# Altium schematic sheet Schema_nixie1.SchDoc
size A4; SheetNumber: 1; SheetTotal: 1
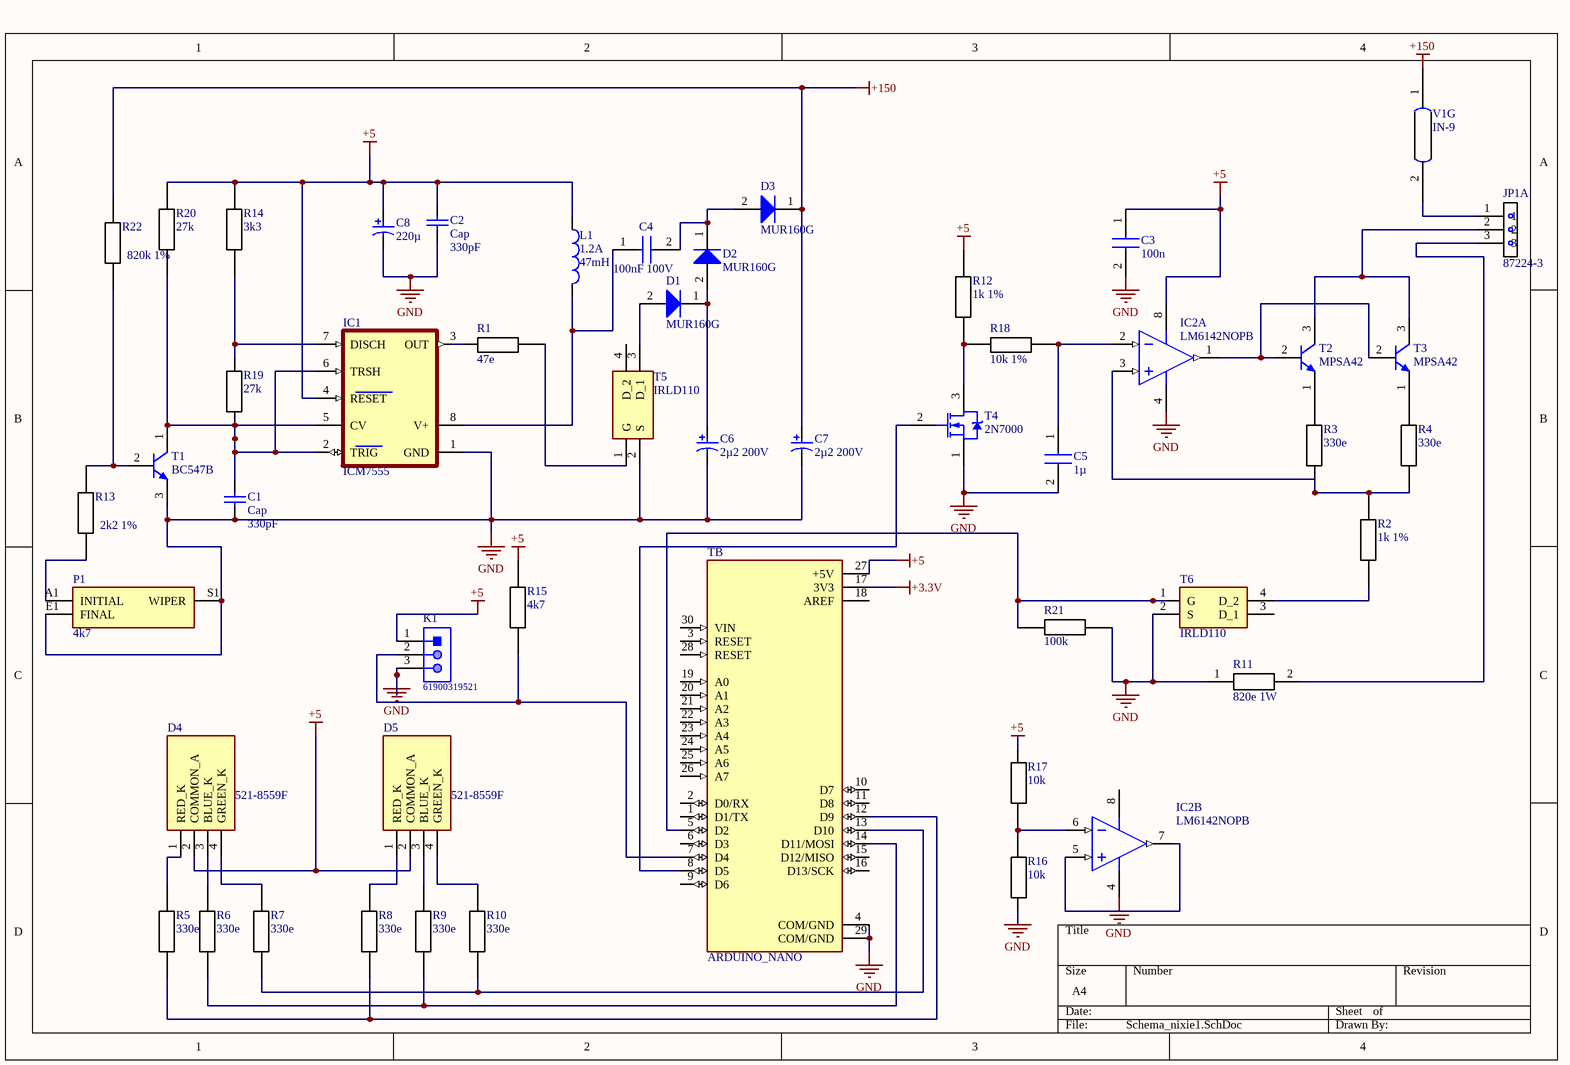
[diagram p0: Schema_nixie1.SchDoc]

## Parts
(Parts that share a designator on the sheet are numbered #1, #2 ... from top to bottom, then left to right.)
C1  Cap  value 330pF  [RAD-0.3]
C2  Cap  value 330pF  [RAD-0.3]
C3  100n  [C330C105K5R5TA7303]
C4  100nF 100V  [BFC247086104]
C5  1µ  [C330C105K5R5TA7303]
C6  2µ2 200V  [CAPPR55-200-1100X500X1200]
C7  2µ2 200V  [CAPPR55-200-1100X500X1200]
C8  220µ  [CAPPR55-200-1100X500X1200]
D1  MUR160G  [ONSC-AXIAL_LEAD-2-59-10_P]
D2  MUR160G  [ONSC-AXIAL_LEAD-2-59-10_P]
D3  MUR160G  [ONSC-AXIAL_LEAD-2-59-10_P]
D4  521-8559F  [5218559F]
D5  521-8559F  [5218559F]
IC1  ICM7555  [DIL08]
IC2#1  LM6142NOPB  [D0008A_L]  (part A of 2)
IC2#2  LM6142NOPB  [D0008A_L]  (part B of 2)
JP1  87224-3  [872243]  (part A of 3)
K1  61900319521  [61900319521]
L1  1.2A  value 47mH  [LHL08TB100K]
P1  4k7  [PT10LV10205A2020S]
R1  47e  [6-0805_N]
R2  1k 1%  [6-0805_N]
R3  330e  [6-0805_N]
R4  330e  [6-0805_N]
R5  330e  [6-0805_N]
R6  330e  [6-0805_N]
R7  330e  [6-0805_N]
R8  330e  [6-0805_N]
R9  330e  [6-0805_N]
R10  330e  [6-0805_N]
R11  820e 1W  [AXIAL-0.7]
R12  1k 1%  [6-0805_N]
R13  2k2 1%  [6-0805_N]
R14  3k3  [6-0805_N]
R15  4k7  [6-0805_N]
R16  10k  [6-0805_N]
R17  10k  [6-0805_N]
R18  10k 1%  [6-0805_N]
R19  27k  [6-0805_N]
R20  27k  [6-0805_N]
R21  100k  [6-0805_N]
R22  820k 1%  [6-0805_N]
T1  BC547B  [ONSC-TO-92-3-29-11]
T2  MPSA42  [ONSC-TO-92-3-29-11]
T3  MPSA42  [ONSC-TO-92-3-29-11]
T4  2N7000  [ONSC-TO-92-3-29-11]
T5  IRLD110  [DIP920W60P254L490H337Q4N]
T6  IRLD110  [DIP920W60P254L490H337Q4N]
TB  ARDUINO_NANO  [SHIELD_ARDUINO_NANO]
V1  IN-9  [PCBComponent_1]  (part G of 7)

## Nets
+3.3V: TB.17(3V3)
+5: C2.2 C3.1 C8.1 D4.2(COMMON_A) D5.2(COMMON_A) IC1.4(RESET) IC2#1.8(V+) K1.1 L1.1 R12.1 R14.1 R15.1 R17.2 R20.1 TB.27(+5V)
+150: C7.1 D3.1(K) R22.1 V1.1
GND: C1.1 C2.1 C3.2 C5.2 C6.2 C7.2 C8.2 IC1.1(GND) IC2#1.4(V-) IC2#2.4(V-) K1.3 P1.E1(FINAL) P1.S1(WIPER) R11.1 R16.1 R21.1 T1.3(E) T4.1(S) T5.2(S) T6.2(S) TB.4(COM/GND) TB.29(COM/GND)
NetC1_2: C1.2 IC1.2(TRIG) IC1.5(CV) IC1.6(TRSH) R19.2 R20.2 T1.1(C)
NetC4_1: C4.1 IC1.8(V+) L1.2
NetC4_2: C4.2 D2.1(K) D3.2(A)
NetC5_1: C5.1 IC2#1.2(INA-) R18.2
NetC6_1: C6.1 D1.1(K) D2.2(A)
NetD1_2: D1.2(A) T5.3(D_1)
NetD4_1: D4.1(RED_K) R5.1
NetD4_3: D4.3(BLUE_K) R6.1
NetD4_4: D4.4(GREEN_K) R7.1
NetD5_1: D5.1(RED_K) R8.1
NetD5_3: D5.3(BLUE_K) R9.1
NetD5_4: D5.4(GREEN_K) R10.1
NetIC1_3: IC1.3(OUT) R1.1
NetIC1_7: IC1.7(DISCH) R14.2 R19.1
NetIC2#1_1: IC2#1.1(OUTA) T2.2(B) T3.2(B)
NetIC2#1_3: IC2#1.3(INA+) R2.1 R3.2 R4.2
NetIC2#2_5: IC2#2.5(INB+) IC2#2.7(OUTB)
NetIC2#2_6: IC2#2.6(INB-) R16.2 R17.1
NetJP1_1: JP1.1 V1.2
NetJP1_2: JP1.2 T2.3(C) T3.3(C)
NetJP1_3: JP1.3 R11.2
NetK1_2: K1.2 R15.2 TB.7(D4)
NetP1_A1: P1.A1(INITIAL) R13.2
NetR1_2: R1.2 T5.1(G)
NetR2_2: R2.2 T6.4(D_2)
NetR3_1: R3.1 T2.1(E)
NetR4_1: R4.1 T3.1(E)
NetR5_2: R5.2 R8.2 TB.12(D9)
NetR6_2: R6.2 R9.2 TB.14(D11/MOSI)
NetR7_2: R7.2 R10.2 TB.13(D10)
NetR12_2: R12.2 R18.1 T4.3(D)
NetR13_1: R13.1 R22.2 T1.2(B)
NetR21_2: R21.2 T6.1(G) TB.5(D2)
NetT4_2: T4.2(G) TB.8(D5)

Not connected (* = marked no-connect by the designer): IC2#2 8(V+); T5 4(D_2); T6 3(D_1); TB 1(D1/TX) 2(D0/RX) 3(RESET) 6(D3) 9(D6) 10(D7) 11(D8) 15(D12/MISO) 16(D13/SCK) 18(AREF) 19(A0) 20(A1) 21(A2) 22(A3) 23(A4) 24(A5) 25(A6) 26(A7) 28(RESET) 30(VIN)

## Library data of the parts
C1 C2 = Cap: Capacitor; Published: 8-Jun-2000; LatestRevisionDate: 17-Jul-2002; LatestRevisionNote: Re-released for DXP Platform.; PackageReference: RAD-0.3; Publisher: Altium Limited; PackageDescription: Radial Cap, Thru-Hole; 2 Leads; 0.3 in Pin Spacing
C3 C5 = C330C105K5R5TA7303: Capacitor; Manufacturer_Name: Kemet; Datasheet Link: https://content.kemet.com/datasheets/KEM_C1050_GOLDMAX_X7R.pdf; Height: 10.66mm; Manufacturer_Part_Number: C330C105K5R5TA7303; Mouser Part Number: 80-C330C105K5R-TR; Mouser Price/Stock: https://www.mouser.com/Search/Refine.aspx?Keyword=80-C330C105K5R-TR; Arrow Part Number: C330C105K5R5TA7303; Arrow Price/Stock: https://www.arrow.com/en/products/c330c105k5r5ta7303/kemet-corporation
C4 = BFC247086104: Capacitor; Manufacturer_Name: Vishay; Datasheet Link: https://www.vishay.com/docs/28112/mkt470.pdf; Height: 8mm; Manufacturer_Part_Number: BFC247086104; Mouser Part Number: 594-2222-470-86104; Mouser Price/Stock: https://www.mouser.co.uk/ProductDetail/Vishay-BC-Components/BFC247086104?qs=m9M%252B25nfdj%2FpVccp3IS4nw%3D%3D; Arrow Part Number: BFC247086104; Arrow Price/Stock: https://www.arrow.com/en/products/bfc247086104/vishay
C6-C8 = CMP-1665-00038-2: Aluminum Electrolytic Capacitor, 10 uF, +/- 20%, 50 V, -40 to 85 degC, 2-Pin THD, RoHS, Bulk; Manufacturer: Panasonic; Life (Hours): 2000Hour; Lead/Base Style: Straight; Dissipation Factor: 0.12%; Capacitance: 10uF; Leakage Current: 3uA; Dielectric Material: Aluminium; Lead Diameter: 0.5mm; Voltage Rating: 50V; Ripple Current: 65mA; Package Reference: CAPPR55-200-1100X500X1200; Height: 11mm; Diameter: 5mm; REACH SVHC: NoSVHC; Mount: ThroughHole; Packaging: Bulk; Manufacturer URL: http://www.panasonic.com/; Termination: Radial; Datasheet URL: https://industrial.panasonic.com/cdbs/www-data/pdf/RDF0000/ABA0000C1218.pdf; Lead Free: LeadFree; Height - Seated (Max): 0.472inch; Case/Package: Radial; Package Description: 2-Pin Radial Lead, Dia 5 mm, Height 12 mm; Tolerance: 20%; Datasheet Version: Rev. 05, 10/2016; Package Quantity: 200; Ripple Current (AC): 65mA; Min Operating Temperature: -40degC; RoHSCompliant: true; Number of Pins: 2; Max Operating Temperature: 85degC; Voltage: 50V; Lead Pitch: 2mm; Radiation Hardening: No; Voltage Rating (DC): 50V; Length: 11mm
D1-D3 = CMP-0902-00129-1: SWITCHMODE(TM) Power Rectifier, 2-Pin Axial_Lead, Pb-Free, Bulk Bag; Manufacturer: On Semiconductor; IFSM Max (A): 35; VRRM Max (V): 600; Type: Ultrafast; PackageVersion: Rev. U, 02/2005; PackageDescription: 2-Pin, Axial Lead, Diameter 2.35 mm; RoHS: TRUE; ComponentLink3Description: Package Specification; ComponentLink3URL: http://www.onsemi.cn/pub_link/Collateral/59-10.PDF; Packing: Bulk Bag; ComponentLink1URL: http://www.onsemi.com/; ComponentLink1Description: Manufacturer URL; ComponentLink2Description: Datasheet; ComponentLink2URL: http://www.onsemi.com/pub_link/Collateral/MUR120-D.PDF; PackageReference: AXIAL_LEAD-2-59-10; Mounting Technology: Through Hole; PartNumber: MUR160G; DatasheetVersion: Rev. 12
D4 D5 = 521-8559F: LED; Manufacturer_Name: Dialight; Datasheet Link: http://www.dialightsignalsandcomponents.com/Assets/Drawings/2D_Drawings_DrawingDetailedSpec/NewDrawings/C18455B.pdf; Height: 8.6mm; Manufacturer_Part_Number: 521-8559F; Mouser Part Number: 645-5218559F; Mouser Price/Stock: https://www.mouser.co.uk/ProductDetail/Dialight/521-8559F/?qs=vmHwEFxEFR%2FyCJVY9sdZTA%3D%3D
IC1 = ICM7555: 555 Tipo, Temporizador / Oscilador (Ãšnico) IC 1MHz 8-SOIC; MF: Renesas Electronics; Availability: Unavailable; Check_prices: https://www.snapeda.com/parts/ICM7555/Renesas%20Electronics%20America%20Inc./view-part/571575/?ref=eda; Value: *; Package: SOIC-8 Renesas Electronics; MP: ICM7555; Price: None; SnapEDA_Link: https://www.snapeda.com/parts/ICM7555/Renesas%20Electronics%20America%20Inc./view-part/571575/?ref=snap
IC2#1 = CMP-0055-00755-3: Dual High Speed/Low Power 17 MHz Rail-to-Rail I/O Operational Amplifier, 8-pin Narrow SOIC, Pb-Free; Manufacturer: Texas Instruments; PackageTopMarking: NSZXTT*LM614*2BIM; PowerWise: N; CompType: Amplifiers; PackageDescription: SOIC Narrow, 4.9 x 3.9 x 1.45mm, 8 Lead, 1.27mm Pitch; ComponentLink1Description: Datasheet URL; Package Reference: D0008A; PinCount: 8; Code_IPC: SOIC127P600-8; RoHS: Y; ComponentLink1URL: http://www.ti.com/general/docs/lit/getliterature.tsp?genericPartNumber=LM6142&fileType=pdf; Code_JEDEC: MS-012-AA
IC2#2 = CMP-0055-00755-3: Dual High Speed/Low Power 17 MHz Rail-to-Rail I/O Operational Amplifier, 8-pin Narrow SOIC, Pb-Free; Manufacturer: Texas Instruments; Manufacturer: TI National Semiconductor; Manufacturer Part Number: LM6142BIM/NOPB; PackageTopMarking: NSZXTT*LM614*2BIM; PowerWise: N; CompType: Amplifiers; PackageDescription: SOIC Narrow, 4.9 x 3.9 x 1.45mm, 8 Lead, 1.27mm Pitch; ComponentLink1Description: Datasheet URL; Package Reference: D0008A; PinCount: 8; Code_IPC: SOIC127P600-8; RoHS: Y; ComponentLink1URL: http://www.ti.com/general/docs/lit/getliterature.tsp?genericPartNumber=LM6142&fileType=pdf; Code_JEDEC: MS-012-AA
JP1 = 87224-3: Connector; Manufacturer_Name: TE Connectivity; Datasheet Link: https://www.mouser.com/datasheet/2/418/NG_CD_87224_L3-1263161.pdf; Height: 10.3632mm; Manufacturer_Part_Number: 87224-3; Mouser Part Number: 571-872243; Mouser Price/Stock: https://www.mouser.co.uk/ProductDetail/TE-Connectivity/87224-3?qs=VKrXD49J9ErediZOfWku7Q%3D%3D; Arrow Part Number: 87224-3; Arrow Price/Stock: https://www.arrow.com/en/products/87224-3/te-connectivity
K1 = CMP-1502-00600-1: Male Top Locking Header WR-WTB, THT, Right Angled, pitch 2.54 mm, 1 x 3 position; Manufacturer: Wurth Elektronik; Working Voltage: 250VAC; Pitch: 2.54mm; Position: 1x3; Contact Resistance: 20mOhm; Package Reference: 61900319521; Manufacturer URL: http://www.we-online.de; Orientation: RightAngled; Operating Temperature: -40to105degC; Publisher: WurthElektronik; Packaging: Bag; Datasheet URL: https://katalog.we-online.de/em/datasheet/6190xx19521.pdf; Gender: Male; Mounting Technology: THT; Part Number: 61900319521
L1 = Inductor: Code_IEC: 1005; Published: 8-Jun-2000; LatestRevisionDate: 29-May-2009; LatestRevisionNote: IPC-7351 Footprint Added.; PackageReference: 0402-A; Publisher: Altium Limited; PackageDescription: Chip Inductor; Code_JEITA: 0402
P1 = PT10LV10-205A2020-S: Variable Resistor; Manufacturer_Name: PIHER; Datasheet Link: https://www.mouser.in/datasheet/2/18/1/12_PT10v03-1499201.pdf; Height: 6.2mm; Manufacturer_Part_Number: PT10LV10-205A2020-S
R1-R10 R12-R22 = Res Thermal: resistor; Published: 24-Mar-1999; LatestRevisionDate: 29-May-2009; LatestRevisionNote: IPC-7351 Footprint Added.; PackageVersion: Mar-2003; PackageReference: 6-0805; Publisher: Altium Limited; PackageDescription: Chip Resistor 0805 Case Size; Code_IPC: RESC2012
R11 = CMP-1018-00072-2: RES Thick Film, 820Ω, 5%, 1W, 200ppm/°C, 2512; Manufacturer: Vishay Dale; Manufacturer Part Number: CRCW2512820RJNEG; Manufacturer: Bourns; Manufacturer Part Number: CR2512-JW-821ELF; Manufacturer: Panasonic; Manufacturer Part Number: ERJ-1TYJ821U; Manufacturer Part Number: CRCW2512820RJNTG; Resistance: 820R; Voltage Rating (DC): 500V; Radiation Hardening: No; Packaging: Tape and Reel; Military Standard: Not; Case Code (Imperial): 2512; Max Power Dissipation: 1W; Package Quantity: 1; Height: 0.028inch; Length: 6.3mm; Depth: 3.15mm; Width: 0.124inch; Weight: 0.001429oz; Features: Automotive AEC-Q200; Tolerance: 5%; Case/Package: 2512; Contact Plating: Tin; Min Operating Temperature: -55°C; Composition: Thick Film; Voltage Rating: 500V; Temperature Coefficient: 200ppm/°C; Case Code (Metric): 6432; Number of Terminations: 2; Lead Free: Lead Free; Power Rating: 1W; Max Operating Temperature: 155°C
T1 = CMP-1048-01467-1: Amplifier Transistor, NPN Silicon, 3-Pin TO-92, Bulk Box; Manufacturer: On Semiconductor; IC Continuous (A): 0.1; fT Min (MHz): 150; DatasheetVersion: Rev. 7; ComponentLink1URL: http://www.onsemi.com/; Polarity: NPN; RoHS: FALSE; ComponentLink1Description: Manufacturer URL; Packing: Bulk Box; PackageDescription: 3-Pin Transistor Outline, Body 4.825 x 3.685 mm, Pitch 1.27 mm; ComponentLink3URL: http://www.onsemi.cn/pub_link/Collateral/2N6426-D.PDF; ComponentLink2Description: Datasheet; PackageVersion: Rev. AM; PackageReference: TO-92-3-29-11_AM_SL; ComponentLink3Description: Package Specification; Mounting Technology: Through Hole; PartNumber: BC547B; ComponentLink2URL: http://www.onsemi.com/pub_link/Collateral/BC546-D.PDF
T2 T3 = CMP-1048-01390-1: High Voltage Transistor, NPN Silicon, 3-Pin TO-92, Bulk Box; Manufacturer: On Semiconductor; fT Min (MHz): 50; Note1: 0; IC Continuous (A): 0.5; ComponentLink3Description: Package Specification; PackageReference: TO-92-3-29-11_AM_SL; Packing: Bulk Box; ComponentLink1URL: http://www.onsemi.com/; PackageDescription: 3-Pin Transistor Outline, Body 4.825 x 3.685 mm, Pitch 1.27 mm; Mounting Technology: Through Hole; RoHS: FALSE; DatasheetVersion: Rev. 8; PackageVersion: Rev. AM; ComponentLink2Description: Datasheet; ComponentLink1Description: Manufacturer URL; ComponentLink2URL: http://www.onsemi.cn/pub_link/Collateral/MPSA42-D.PDF; ComponentLink3URL: http://www.onsemi.cn/pub_link/Collateral/2N6426-D.PDF; Polarity: NPN; PartNumber: MPSA42
T4 = CMP-1058-00936-1: Small Signal MOSFET, 200 mA, 60 V, N-Channel, 3-Pin TO-92, Bulk Box; Manufacturer: On Semiconductor; Ciss Typ (pF): 60; VGS(th) Max (V): 3; Crss Typ (pF): 5; Channel Polarity: N Channel; VGS Max (V): 20; Configuration: Single; PD Max (W): 0.35; Coss Typ (pF): 25; ID Max (A): 0.2; PackageVersion: Rev. AM; ComponentLink3URL: http://www.onsemi.cn/pub_link/Collateral/2N6426-D.PDF; ComponentLink2URL: http://www.onsemi.com/pub_link/Collateral/2N7000-D.PDF; DatasheetVersion: Rev. 8; Mounting Technology: Through Hole; V(BR)DSS Min (V): 60; PartNumber: 2N7000; PackageDescription: 3-Pin Transistor Outline, Body 4.825 x 3.685 mm, Pitch 1.27 mm; ComponentLink2Description: Datasheet; ComponentLink1URL: http://www.onsemi.com/; PackageReference: TO-92-3-29-11_AM_SL; Packing: Bulk Box; ComponentLink1Description: Manufacturer URL; Package Type: TO-92; ComponentLink3Description: Package Specification
T5 T6 = IRLD110PBF: MOSFET (N-Channel); Manufacturer_Name: Vishay; Datasheet Link: http://uk.rs-online.com/web/p/products/0301338P; Height: 3.37mm; Manufacturer_Part_Number: IRLD110PBF; Mouser Part Number: 844-IRLD110PBF; Mouser Price/Stock: https://www.mouser.co.uk/ProductDetail/Vishay-Siliconix/IRLD110PBF?qs=cvaI6ThkwxutctgzXpBGHg%3D%3D; Arrow Part Number: IRLD110PBF; Arrow Price/Stock: https://www.arrow.com/en/products/irld110pbf/vishay
TB = ARDUINO_NANO: ATSAMD21G18A Arduino Nano 33 IoT SAM D ARMÂ® CortexÂ®-M0+ MCU 32-Bit Embedded Evaluation Board; MP: ARDUINO NANO; Package: None; Price: None; Availability: Unavailable; Value: *; MF: Arduino; SnapEDA_Link: https://www.snapeda.com/parts/ARDUINO%20NANO/Arduino/view-part/1128261/?ref=snap
V1 = Component_1